# EAGLE design floor (EAGLE 7.6.0)
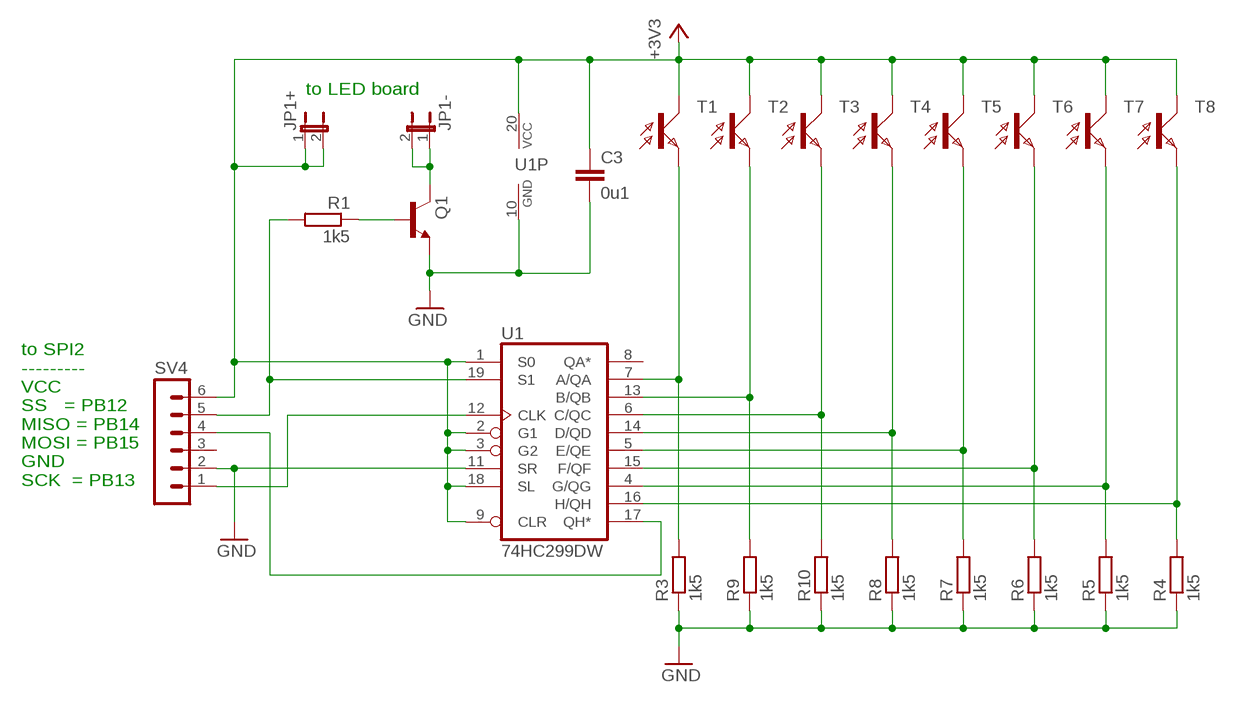
[diagram p0: schematic, sheet 1]

## Parts
C3  0u1  C-EUC0805  [C0805]
JP1+  JP1E  [JP1]
JP1-  JP1E  [JP1]
Q1  BC817-25SMD  [SOT23-BEC]
R1  1k5  R-EU_M0805  [M0805]
R3  1k5  R-EU_M0805  [M0805]
R4  1k5  R-EU_M0805  [M0805]
R5  1k5  R-EU_M0805  [M0805]
R6  1k5  R-EU_M0805  [M0805]
R7  1k5  R-EU_M0805  [M0805]
R8  1k5  R-EU_M0805  [M0805]
R9  1k5  R-EU_M0805  [M0805]
R10  1k5  R-EU_M0805  [M0805]
SV4  MA06-1  [MA06-1]
T1  PT17-21B  PHOTOTRANSISTOR  [CHIPLED_0805]
T2  PT17-21B  PHOTOTRANSISTOR  [CHIPLED_0805]
T3  PT17-21B  PHOTOTRANSISTOR  [CHIPLED_0805]
T4  PT17-21B  PHOTOTRANSISTOR  [CHIPLED_0805]
T5  PT17-21B  PHOTOTRANSISTOR  [CHIPLED_0805]
T6  PT17-21B  PHOTOTRANSISTOR  [CHIPLED_0805]
T7  PT17-21B  PHOTOTRANSISTOR  [CHIPLED_0805]
T8  PT17-21B  PHOTOTRANSISTOR  [CHIPLED_0805]
U1  74HC299DW  [SO20W]

## Nets
+3V3: C3.1 JP1+.1 JP1+.2 SV4.6 T1.C T2.C T3.C T4.C T5.C T6.C T7.C T8.C U1.1(S0) U1.2(G1) U1.3(G2) U1.9(CLR) U1.18(SL) U1.20(VCC)
GND: C3.2 Q1.E R3.1 R4.1 R5.1 R6.1 R7.1 R8.1 R9.1 R10.1 SV4.2 U1.10(GND) U1.11(SR)
N$1: R3.2 T1.A(E) U1.7(A/QA)
N$2: JP1-.1 JP1-.2 Q1.C
N$3: R4.2 T8.A(E) U1.16(H/QH)
N$4: R9.2 T2.A(E) U1.13(B/QB)
N$5: R10.2 T3.A(E) U1.6(C/QC)
N$6: R8.2 T4.A(E) U1.14(D/QD)
N$7: R7.2 T5.A(E) U1.5(E/QE)
N$8: R6.2 T6.A(E) U1.15(F/QF)
N$9: R5.2 T7.A(E) U1.4(G/QG)
N$10: SV4.1 U1.12(CLK)
N$11: SV4.4 U1.17(QH*)
N$12: R1.2 SV4.5 U1.19(S1)
N$13: Q1.B R1.1
Unconnected: SV4.3 U1.8(QA*)

## Notes on the sheet
- to LED board
- to SPI2
  ---------
  VCC
  SS   = PB12
  MISO = PB14
  MOSI = PB15
  GND
  SCK  = PB13

## Library data of the parts
C3 = rcl:C-EU: CAPACITOR, European symbol
JP1+ JP1- = jumper:JP1E: JUMPER
Q1 = transistor-npn:BC817*: NPN Transistor
R1 R3-R10 = rcl:R-EU_: RESISTOR, European symbol
SV4 = ensylam:MA06-1: PIN HEADER; OC_FARNELL: unknown; OC_NEWARK: unknown
T1-T8 = ensylam:PHOTOTRANSISTOR: PHOTO TRANSISTOR
U1 = 74xx-eu:74*299: 8-bit universal SHIFT/STORAGE REGISTER

## Board
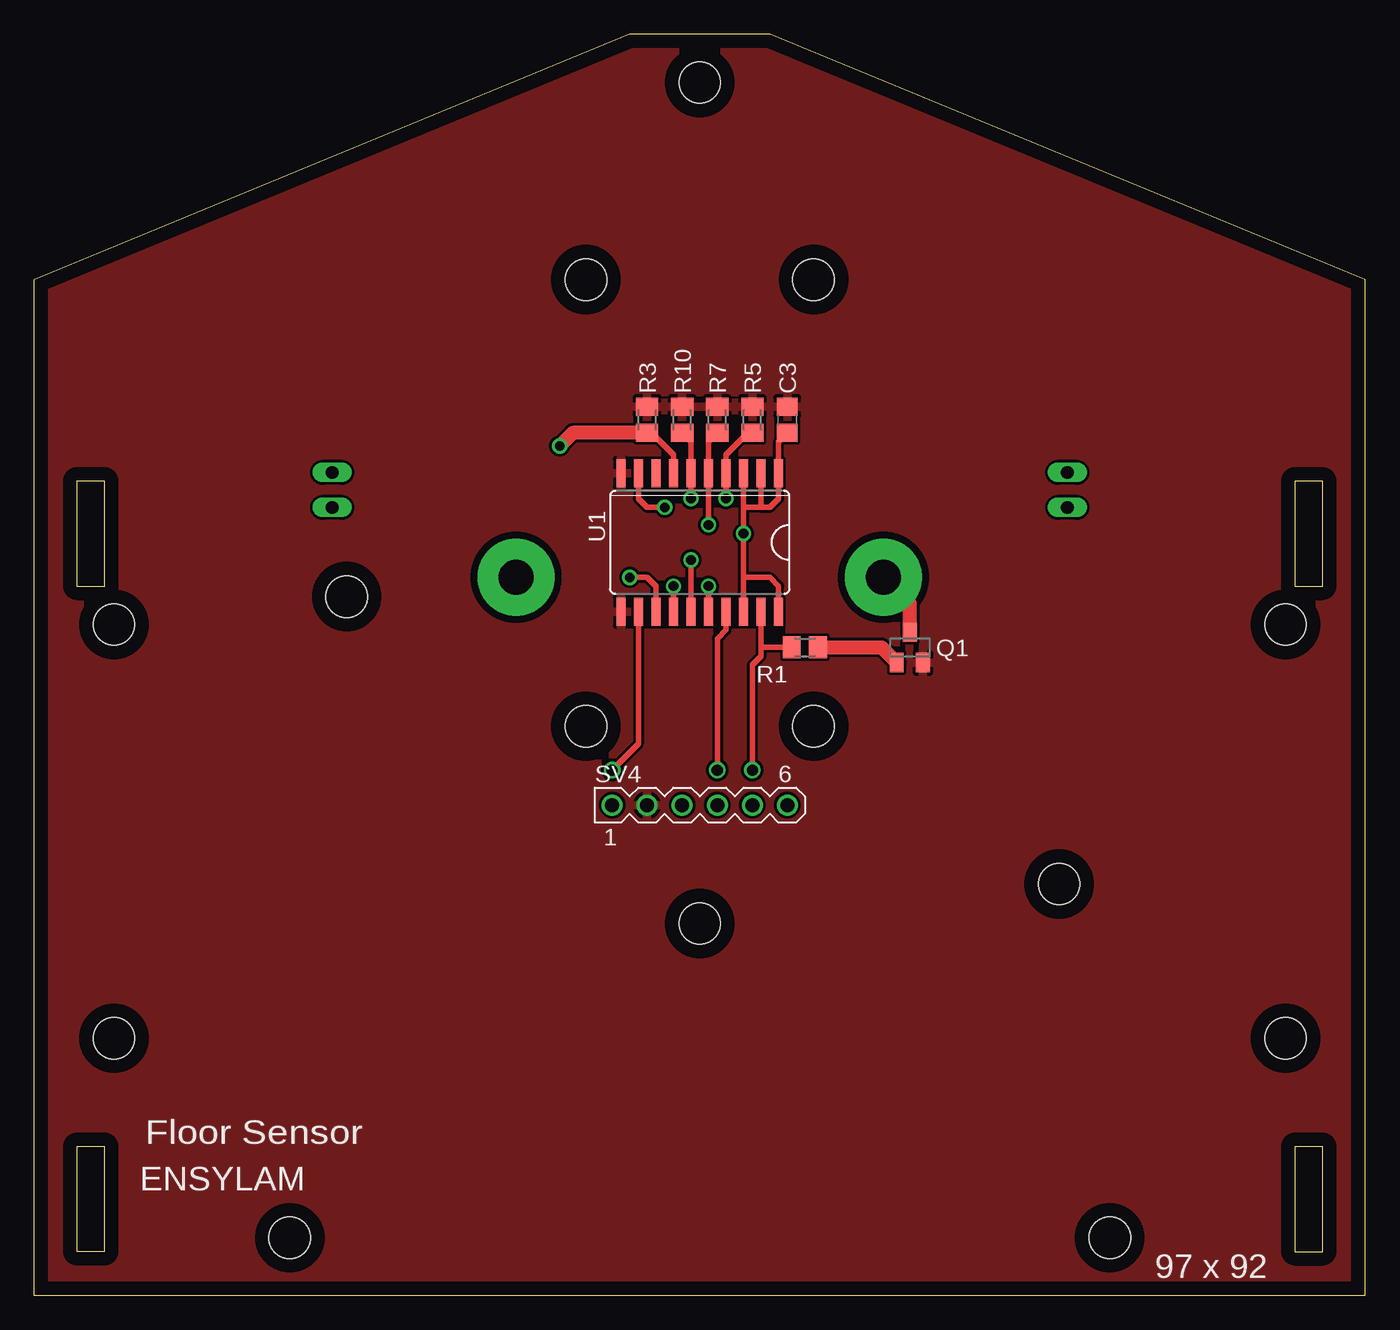
[diagram p1: board, top side]
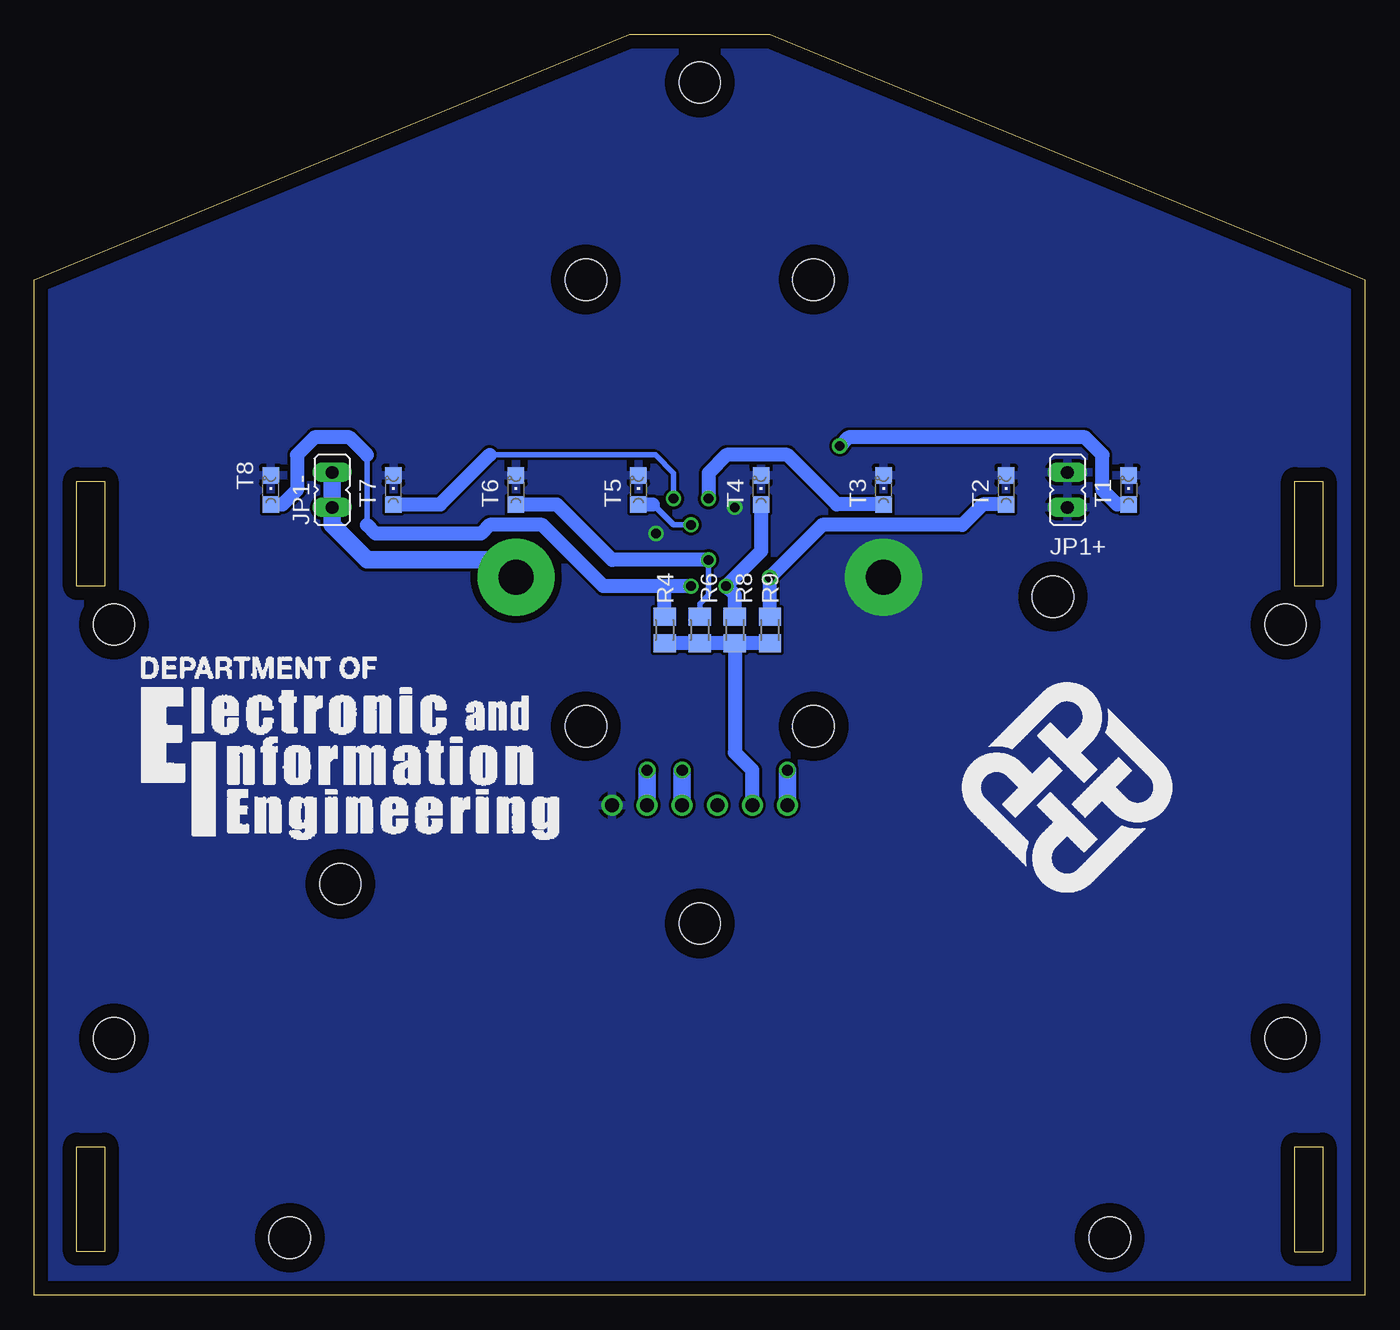
[diagram p2: board, bottom side, seen from below]

Size 96.52 x 91.44 mm. Coordinates in mm from the lower left corner, seen from the top.
Outline: 0,0 96.52,0 96.52,73.66 53.34,91.44 43.18,91.44 0,73.66 0,0
Outline: 3.08,59.05 3.08,51.44 5.08,51.44 5.08,59.05 3.08,59.05
Outline: 91.44,59.05 91.44,51.44 93.44,51.44 93.44,59.05 91.44,59.05
Outline: 3.08,10.79 3.08,3.17 5.08,3.17 5.08,10.79 3.08,10.79
Outline: 91.44,10.79 91.44,3.17 93.44,3.17 93.44,10.79 91.44,10.79
Copper layers (1*16): Top 0.035mm / dielectric 1.5mm / Bottom 0.035mm
Design rules "default": minimum track width 10mil, minimum drill 24mil, track to track 8mil, track to pad 8mil, pad to pad 8mil, via to via 8mil, smd to smd 8mil, copper to edge 40mil, drill to drill 8mil, minimum pad ring 10mil, minimum via ring 8mil, stop-mask expansion 4mil, vias tented up to drill 0mil, thermal gap 10mil
Holes 3 mm at 74.33,29.84 22.64,50.67 78,4.19 18.52,4.19 56.52,41.27 40.01,41.27 48.26,26.98 5.76,48.66 90.76,48.66 90.76,18.65 5.76,18.65 40.01,73.66 56.52,73.66 48.26,87.96
tRestrict: area 58.8,49.3 to 64.4,54.9; area 32.1,49.3 to 37.7,54.9
bRestrict: area 58.8,49.3 to 64.4,54.9

### Footprints (pad centres in the part's own frame; a part is rotated, then mirrored left to right if it is on the bottom)
C0805 = smd 1.3 x 1.5: 1 -0.95,0; 2 0.95,0
JP1 = drill 0.914 long: 1 0,-1.27; 2 0,1.27
SOT23-BEC = smd 1 x 1.4: B -0.95,-1.1; C 0,1.1; E 0.95,-1.1
M0805 = smd 1.3 x 1.6: 1 -0.95,0; 2 0.95,0
MA06-1 = drill 1.016: 1 -6.35,0; 2 -3.81,0; 3 -1.27,0; 4 1.27,0; 5 3.81,0; 6 6.35,0
CHIPLED_0805 = smd 1.2 x 1.2: A 0,-1.05; C 0,1.05
SO20W = smd 0.66 x 2.032: 1 -5.715,-5.029; 2 -4.445,-5.029; 3 -3.175,-5.029; 4 -1.905,-5.029; 5 -0.635,-5.029; 6 0.635,-5.029; 7 1.905,-5.029; 8 3.175,-5.029; 9 4.445,-5.029; 10 5.715,-5.029; 11 5.715,5.029; 12 4.445,5.029; 13 3.175,5.029; 14 1.905,5.029; 15 0.635,5.029; 16 -0.635,5.029; 17 -1.905,5.029; 18 -3.175,5.029; 19 -4.445,5.029; 20 -5.715,5.029

### Placement (x,y rotation side)
C3  54.61,63.5 90 top
JP1+  21.59,58.42 0 bottom
JP1-  74.93,58.42 0 bottom
Q1  63.5,46.99 0 top
R1  55.88,46.99 180 top
R3  44.45,63.5 270 top
R4  50.8,48.26 90 bottom
R5  52.07,63.5 270 top
R6  48.26,48.26 90 bottom
R7  49.53,63.5 270 top
R8  45.72,48.26 90 bottom
R9  43.18,48.26 90 bottom
R10  46.99,63.5 270 top
SV4  48.26,35.56 0 top
T1  17.14,58.42 0 bottom
T2  26.04,58.42 0 bottom
T3  34.92,58.42 0 bottom
T4  43.81,58.42 0 bottom
T5  52.7,58.42 0 bottom
T6  61.59,58.42 0 bottom
T7  70.48,58.42 0 bottom
T8  79.38,58.42 0 bottom
U1  48.26,54.61 180 top
U$1  [EIE]  88.9,33.02 0 bottom
U$2  [POLYU]  21.59,36.83 0 bottom

### Tracks (layer width: path | path; a pad name or v marks a point on that pad's centre or on a via)
+3V3  (via drill 0.7, 2.54 pad 5.59)
  Top 0.406: U1.3 51.44,57.15 | 51.44,57.15 v51.44,55.24 51.44,52.07 | 51.44,52.07 53.34,52.07 53.98,51.44 U1.20 | U1.18 51.44,52.07 | U1.9 43.81,57.78 44.45,57.15 v45.72,57.15 | C3.1 53.98,61.91 U1.1 53.98,57.78 53.34,57.15 52.7,57.15 | 52.7,57.15 51.44,57.15 | U1.2 52.7,57.15
  other vias: 34.92,52.07
  pour Bottom: 96.52,91.44 0,91.44 0,0 96.52,0
GND
  Bottom 1.016: R8.1 R6.1 R4.1 | R8.1 45.72,39.37 44.45,38.1 SV4.2 | R9.1 R8.1
  pour Top: 96.52,91.44 0,91.44 0,0 96.52,0
N$1  (via drill 0.7)
  Top 0.406: U1.7 46.35,60.96 44.77,62.55 R3.2
  Top 1.016: R3.2 39.05,62.55 v38.1,61.59
  Bottom 1.016: T1.A 18,57.37 19.05,58.42 19.05,60.96 20.32,62.23 37.47,62.23 v38.1,61.59
N$2  (via drill 2.54 pad 5.59)
  Top 1.016: Q1.C 63.5,50.16 v61.59,52.07
  Bottom 1.27: JP1-.2 JP1-.1 74.93,55.88 72.39,53.34 62.87,53.34 v61.59,52.07
N$3  (via drill 0.7)
  Top 0.406: v48.9,51.44 U1.16
  Bottom 0.406: 72.39,55.88 72.39,60.96
  Bottom 1.016: v48.9,51.44 50.8,51.44 | 50.8,51.44 55.24,51.44 59.69,55.88 63.5,55.88 64.14,55.24 71.75,55.24 72.39,55.88 | 72.39,60.96 73.66,62.23 76.2,62.23 77.47,60.96 77.47,58.42 78.52,57.37 T8.A | R4.2 50.8,51.44
N$4  (via drill 0.7)
  Top 0.406: U1.13 45.09,51.44 44.45,52.07 v43.18,52.07
  Bottom 1.016: T2.A 27.72,57.37 29.21,55.88 39.37,55.88 v43.18,52.07 R9.2
N$5  (via drill 0.7)
  Top 0.406: v47.62,57.78 U1.6 47.62,61.91 R10.2
  Bottom 1.016: T3.A 38.32,57.37 41.91,60.96 46.3,60.96 U1.6 v47.62,57.78
N$6  (via drill 0.7)
  Top 0.406: v46.35,51.44 U1.14
  Bottom 1.016: T4.A 43.81,53.98 v46.35,51.44 45.72,50.8 R8.2
N$7  (via drill 0.7)
  Top 0.406: R7.2 48.9,61.91 U1.5 v48.9,55.88
  Bottom 0.406: 51.66,57.37 50.16,55.88 v48.9,55.88
  Bottom 1.016: T5.A 51.66,57.37
N$8  (via drill 0.7)
  Top 0.406: U1.15 v47.62,53.34
  Bottom 0.406: R6.2 48.26,50.16 47.62,50.8 v47.62,53.34
  Bottom 1.016: v47.62,53.34 54.61,53.34 58.64,57.37 T6.A
N$9  (via drill 0.7)
  Top 0.406: R5.2 51.76,62.55 50.16,60.96 U1.4 v50.16,57.78
  Bottom 0.406: v50.16,57.78 U1.4 51.49,60.96 63.5,60.96
  Bottom 1.016: T7.A 67.09,57.37 63.5,60.96
N$10  (via drill 0.8)
  Top 0.406: U1.12 43.81,40.01 v41.91,38.1
  Bottom 1.27: SV4.1 v41.91,38.1
N$11  (via drill 0.8)
  Top 0.406: U1.17 50.16,48.26 49.53,47.62 v49.53,38.1
  Bottom 1.27: v49.53,38.1 SV4.4
N$12  (via drill 0.8)
  Top 0.406: U1.19 52.7,46.99 | 52.7,46.99 52.7,46.35 52.07,45.72 v52.07,38.1 | R1.2 52.7,46.99
  Bottom 1.27: SV4.5 v52.07,38.1
N$13
  Top 1.016: R1.1 61.45,46.99 Q1.B

### Text on the board
tPlace: Floor Sensor | ENSYLAM | 97 x 92
tDocu: SCK / GND / MOSI / MISO / PB12 / VCC
bDocu: VCC / PB12 / MISO / MOSI / GND / SCK